# EAGLE schematic rpi (EAGLE 7.1.1)
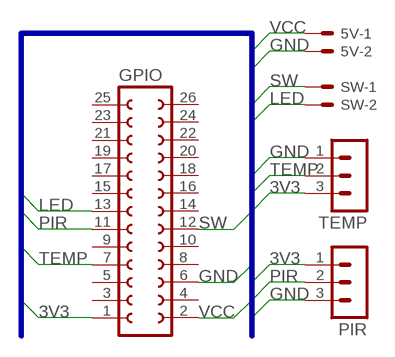
[diagram p0: schematic, sheet 1]

## Parts
5V  22-23-2021  [22-23-2021]
GPIO  FE13-2  [FE13-2]
PIR  MA03-1  [MA03-1]
SW  22-23-2021  [22-23-2021]
TEMP  MA03-1  [MA03-1]

## Nets
3V3: GPIO.1 PIR.1 TEMP.3
GND: 5V.2 GPIO.6 PIR.3 TEMP.1
LED: GPIO.13 SW.2
PIR: GPIO.11 PIR.2
SW: GPIO.12 SW.1
TEMP: GPIO.7 TEMP.2
VCC: 5V.1 GPIO.2
Unconnected: GPIO.3 GPIO.4 GPIO.5 GPIO.8 GPIO.9 GPIO.10 GPIO.14 GPIO.15 GPIO.16 GPIO.17 GPIO.18 GPIO.19 GPIO.20 GPIO.21 GPIO.22 GPIO.23 GPIO.24 GPIO.25 GPIO.26

## Buses
B$1

## Library data of the parts
5V SW = con-molex:22-23-2021: .100" (2.54mm) Center Header - 2 Pin; MF: MOLEX; MPN: 22-23-2021; OC_FARNELL: 1462926; OC_NEWARK: 25C3832
GPIO = con-lsta:FE13-2: FEMALE HEADER; OC_FARNELL: unknown; OC_NEWARK: unknown
PIR TEMP = con-lstb:MA03-1: PIN HEADER; OC_FARNELL: unknown; OC_NEWARK: unknown